# EAGLE schematic Weapons panel (EAGLE 6.5.0)
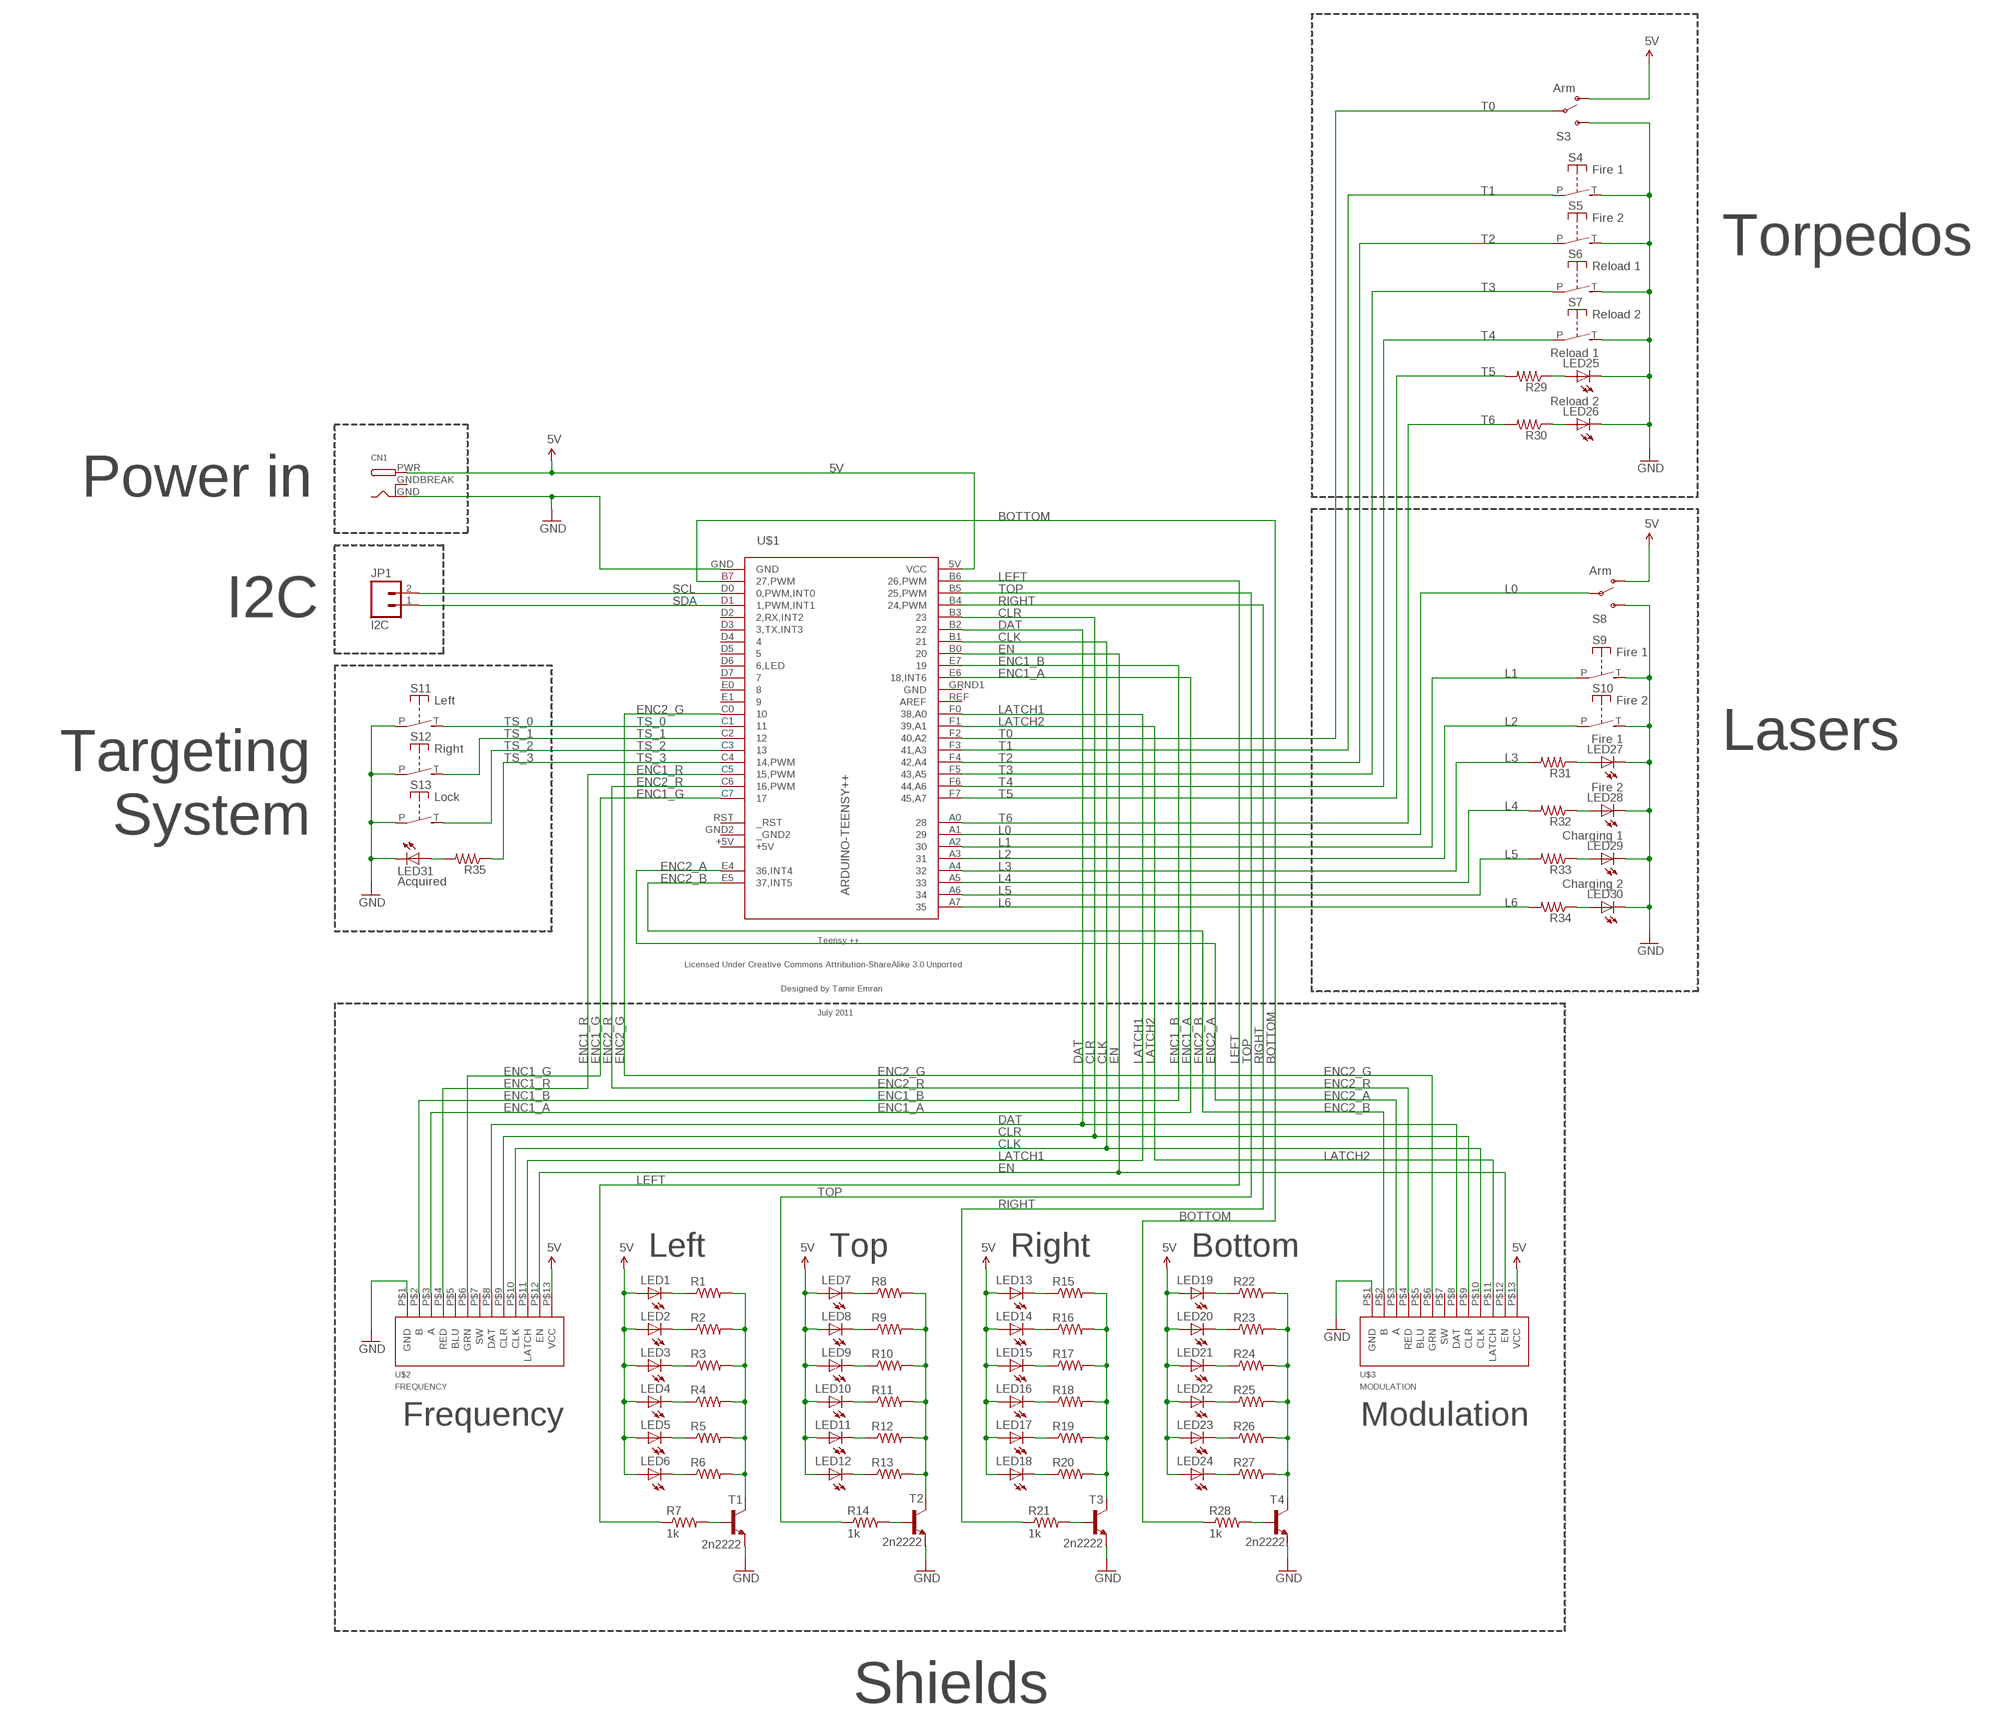
[diagram p0: schematic, sheet 1]

## Parts
CN1  DCBARRELPTH  [DCJACK_2MM_PTH]
JP1  I2C  M02PTH  [1X02]
LED1  LED5MM  [LED5MM]
LED2  LED5MM  [LED5MM]
LED3  LED5MM  [LED5MM]
LED4  LED5MM  [LED5MM]
LED5  LED5MM  [LED5MM]
LED6  LED5MM  [LED5MM]
LED7  LED5MM  [LED5MM]
LED8  LED5MM  [LED5MM]
LED9  LED5MM  [LED5MM]
LED10  LED5MM  [LED5MM]
LED11  LED5MM  [LED5MM]
LED12  LED5MM  [LED5MM]
LED13  LED5MM  [LED5MM]
LED14  LED5MM  [LED5MM]
LED15  LED5MM  [LED5MM]
LED16  LED5MM  [LED5MM]
LED17  LED5MM  [LED5MM]
LED18  LED5MM  [LED5MM]
LED19  LED5MM  [LED5MM]
LED20  LED5MM  [LED5MM]
LED21  LED5MM  [LED5MM]
LED22  LED5MM  [LED5MM]
LED23  LED5MM  [LED5MM]
LED24  LED5MM  [LED5MM]
LED25  Reload 1  LED5MM  [LED5MM]
LED26  Reload 2  LED5MM  [LED5MM]
LED27  Fire 1  LED5MM  [LED5MM]
LED28  Fire 2  LED5MM  [LED5MM]
LED29  Charging 1  LED5MM  [LED5MM]
LED30  Charging 2  LED5MM  [LED5MM]
LED31  Acquired  LED5MM  [LED5MM]
R1  RESISTORKIT  [AXIAL-0.3-KIT]
R2  RESISTORKIT  [AXIAL-0.3-KIT]
R3  RESISTORKIT  [AXIAL-0.3-KIT]
R4  RESISTORKIT  [AXIAL-0.3-KIT]
R5  RESISTORKIT  [AXIAL-0.3-KIT]
R6  RESISTORKIT  [AXIAL-0.3-KIT]
R7  1k  RESISTORKIT  [AXIAL-0.3-KIT]
R8  RESISTORKIT  [AXIAL-0.3-KIT]
R9  RESISTORKIT  [AXIAL-0.3-KIT]
R10  RESISTORKIT  [AXIAL-0.3-KIT]
R11  RESISTORKIT  [AXIAL-0.3-KIT]
R12  RESISTORKIT  [AXIAL-0.3-KIT]
R13  RESISTORKIT  [AXIAL-0.3-KIT]
R14  1k  RESISTORKIT  [AXIAL-0.3-KIT]
R15  RESISTORKIT  [AXIAL-0.3-KIT]
R16  RESISTORKIT  [AXIAL-0.3-KIT]
R17  RESISTORKIT  [AXIAL-0.3-KIT]
R18  RESISTORKIT  [AXIAL-0.3-KIT]
R19  RESISTORKIT  [AXIAL-0.3-KIT]
R20  RESISTORKIT  [AXIAL-0.3-KIT]
R21  1k  RESISTORKIT  [AXIAL-0.3-KIT]
R22  RESISTORKIT  [AXIAL-0.3-KIT]
R23  RESISTORKIT  [AXIAL-0.3-KIT]
R24  RESISTORKIT  [AXIAL-0.3-KIT]
R25  RESISTORKIT  [AXIAL-0.3-KIT]
R26  RESISTORKIT  [AXIAL-0.3-KIT]
R27  RESISTORKIT  [AXIAL-0.3-KIT]
R28  1k  RESISTORKIT  [AXIAL-0.3-KIT]
R29  R-US_0204/7  [0204/7]
R30  R-US_0204/7  [0204/7]
R31  R-US_0204/7  [0204/7]
R32  R-US_0204/7  [0204/7]
R33  R-US_0204/7  [0204/7]
R34  R-US_0204/7  [0204/7]
R35  R-US_0204/7  [0204/7]
S3  Arm  SWITCH-SPDTPTH  [SWITCH-SPDT]
S4  Fire 1  SPST  [JUDCOSPST]
S5  Fire 2  SPST  [JUDCOSPST]
S6  Reload 1  SPST  [JUDCOSPST]
S7  Reload 2  SPST  [JUDCOSPST]
S8  Arm  SWITCH-SPDTPTH  [SWITCH-SPDT]
S9  Fire 1  SPST  [JUDCOSPST]
S10  Fire 2  SPST  [JUDCOSPST]
S11  Left  SPST  [JUDCOSPST]
S12  Right  SPST  [JUDCOSPST]
S13  Lock  SPST  [JUDCOSPST]
T1  2n2222  2N2222-NPN-TO92-EBC  [TO92-EBC]
T2  2n2222  2N2222-NPN-TO92-EBC  [TO92-EBC]
T3  2n2222  2N2222-NPN-TO92-EBC  [TO92-EBC]
T4  2n2222  2N2222-NPN-TO92-EBC  [TO92-EBC]
U$1  ARDUINO-TEENSY++  [TEENSY++]
U$2  FREQUENCY  CIRCULAR_LED_BREAKOUT  [CIRCULAR_LED_BREAKOUT]
U$3  MODULATION  CIRCULAR_LED_BREAKOUT  [CIRCULAR_LED_BREAKOUT]

## Nets
5V: CN1.PWR LED1.A LED2.A LED3.A LED4.A LED5.A LED6.A LED7.A LED8.A LED9.A LED10.A LED11.A LED12.A LED13.A LED14.A LED15.A LED16.A LED17.A LED18.A LED19.A LED20.A LED21.A LED22.A LED23.A LED24.A S3.1(O) S8.1(O) U$1.5V(VCC) U$2.P$13(VCC) U$3.P$13(VCC)
BOTTOM: R28.P$1 U$1.B7(27,PWM)
CLK: U$1.B1 U$2.P$10(CLK) U$3.P$10(CLK)
CLR: U$1.B3 U$2.P$9(CLR) U$3.P$9(CLR)
DAT: U$1.B2 U$2.P$8(DAT) U$3.P$8(DAT)
EN: U$1.B0 U$2.P$12(EN) U$3.P$12(EN)
ENC1_A: U$1.E6(18,INT6) U$2.P$3(A)
ENC1_B: U$1.E7 U$2.P$2(B)
ENC1_G: U$1.C7 U$2.P$6(GRN)
ENC1_R: U$1.C5(15,PWM) U$2.P$4(RED)
ENC2_A: U$1.E4(36,INT4) U$3.P$3(A)
ENC2_B: U$1.E5(37,INT5) U$3.P$2(B)
ENC2_G: U$1.C0 U$3.P$6(GRN)
ENC2_R: U$1.C6(16,PWM) U$3.P$4(RED)
GND: CN1.GND LED25.K(C) LED26.K(C) LED27.K(C) LED28.K(C) LED29.K(C) LED30.K(C) LED31.K(C) S3.3(S) S4.T(S) S5.T(S) S6.T(S) S7.T(S) S8.3(S) S9.T(S) S10.T(S) S11.P S12.P S13.P T1.E T2.E T3.E T4.E U$1.GND U$2.P$1(GND) U$3.P$1(GND)
L0: S8.2(P) U$1.A1
L1: S9.P U$1.A2
L2: S10.P U$1.A3
L3: R31.2 U$1.A4
L4: R32.2 U$1.A5
L5: R33.2 U$1.A6
L6: R34.2 U$1.A7
LATCH1: U$1.F0(38,A0) U$2.P$11(LATCH)
LATCH2: U$1.F1(39,A1) U$3.P$11(LATCH)
LEFT: R7.P$1 U$1.B6(26,PWM)
N$1: LED1.K(C) R1.P$1
N$2: LED2.K(C) R2.P$1
N$3: LED3.K(C) R3.P$1
N$4: LED4.K(C) R4.P$1
N$5: LED5.K(C) R5.P$1
N$6: LED6.K(C) R6.P$1
N$7: R1.P$2 R2.P$2 R3.P$2 R4.P$2 R5.P$2 R6.P$2 T1.C
N$8: R7.P$2 T1.B
N$9: LED7.K(C) R8.P$1
N$10: LED8.K(C) R9.P$1
N$11: LED9.K(C) R10.P$1
N$12: LED10.K(C) R11.P$1
N$13: LED11.K(C) R12.P$1
N$14: LED12.K(C) R13.P$1
N$15: R8.P$2 R9.P$2 R10.P$2 R11.P$2 R12.P$2 R13.P$2 T2.C
N$16: R14.P$2 T2.B
N$17: LED13.K(C) R15.P$1
N$18: LED14.K(C) R16.P$1
N$19: LED15.K(C) R17.P$1
N$20: LED16.K(C) R18.P$1
N$21: LED17.K(C) R19.P$1
N$22: LED18.K(C) R20.P$1
N$23: R15.P$2 R16.P$2 R17.P$2 R18.P$2 R19.P$2 R20.P$2 T3.C
N$24: R21.P$2 T3.B
N$25: LED19.K(C) R22.P$1
N$26: LED20.K(C) R23.P$1
N$27: LED21.K(C) R24.P$1
N$28: LED22.K(C) R25.P$1
N$29: LED23.K(C) R26.P$1
N$30: LED24.K(C) R27.P$1
N$31: R22.P$2 R23.P$2 R24.P$2 R25.P$2 R26.P$2 R27.P$2 T4.C
N$32: R28.P$2 T4.B
N$33: LED25.A R29.1
N$34: LED26.A R30.1
N$35: LED27.A R31.1
N$36: LED28.A R32.1
N$37: LED29.A R33.1
N$38: LED30.A R34.1
N$39: LED31.A R35.2
RIGHT: R21.P$1 U$1.B4(24,PWM)
SCL: JP1.2 U$1.D0(0,PWM,INT0)
SDA: JP1.1 U$1.D1(1,PWM,INT1)
T0: S3.2(P) U$1.F2(40,A2)
T1: S4.P U$1.F3(41,A3)
T2: S5.P U$1.F4(42,A4)
T3: S6.P U$1.F5(43,A5)
T4: S7.P U$1.F6(44,A6)
T5: R29.2 U$1.F7(45,A7)
T6: R30.2 U$1.A0
TOP: R14.P$1 U$1.B5(25,PWM)
TS_0: S11.T(S) U$1.C1
TS_1: S12.T(S) U$1.C2
TS_2: S13.T(S) U$1.C3
TS_3: R35.1 U$1.C4(14,PWM)
Unconnected: U$1.D2(2,RX,INT2) U$1.D3(3,TX,INT3) U$1.D4 U$1.D5 U$1.D6(6,LED) U$1.D7 U$1.E0 U$1.E1 U$1.REF(AREF) U$1.RST(_RST) U$2.P$5(BLU) U$2.P$7(SW) U$3.P$5(BLU) U$3.P$7(SW)

## Notes on the sheet
- Torpedos
- Power in
- I2C
- Lasers
- Targeting
  System
- Left | Top | Right | Bottom
- Frequency | Modulation
- Shields

## Power pins joined to a net without a drawn wire
+5V: U$1.+5V
_GND2: U$1.GND2(_GND2)
GND: U$1.GRND1(GND)
GNDBREAK: CN1.GNDBREAK

## Library data of the parts
CN1 = adafruit:DCBARREL: 2.0mm DC Barrel Jack DCJACK_2MM_PTH - Through Hole Jack (4UConnector: 05537)
JP1 = SparkFun-Connectors:M02: Standard 2-pin 0.1" header. Use with - straight break away headers ( PRT-00116) - right angle break away headers (PRT-00553) - swiss pins (PRT-00743) - machine pins (PRT-00117) - female headers (PRT-00115) Molex polarized connector foot print use with: PRT-08233 with associated crimp pins and housings. 2.54_SCREWTERM for use with PRT-10571. 3.5mm Screw Terminal footprints for PRT-08084 5mm Screw Terminal footprints for use with PRT-08433
LED1-LED31 = adafruit:LED: LED OSRAM: - CHIPLED LG R971, LG N971, LY N971, LG Q971, LY Q971, LO R971, LY R971 LH N974, LH R974 LS Q976, LO Q976, LY Q976 LO Q996 - Hyper CHIPLED LW Q18S LB Q993, LB Q99A, LB R99A - SideLED LS A670, LO A670, LY A670, LG A670, LP A670 LB A673, LV A673, LT A673, LW A673 LH A674 LY A675 LS A676, LA A676, LO A676, LY A676, LW A676 LS A679, LY A679, LG A679 - Hyper Micro SIDELED® LS Y876, LA Y876, LO Y876, LY Y876 LT Y87S - SmartLED LW L88C, LW L88S LB L89C, LB L89S, LG L890 LS L89K, LO L89K, LY L89K LS L896, LA L896, LO L896, LY L896 - TOPLED LS T670, LO T670, LY T670, LG T670, LP T670 LSG T670, LSP T670, LSY T670, LOP T670, LYG T670 LG T671, LOG T671, LSG T671 LB T673, LV T673, LT T673, LW T673 LH T674 LS T676, LA T676, LO T676, LY T676, LB T676, LH T676, LSB T676, LW T676 LB T67C, LV T67C, LT T67C, LS T67K, LO T67K, LY T67K, LW E67C LS E67B, LA E67B, LO E67B, LY E67B, LB E67C, LV E67C, LT E67C LW T67C LS T679, LY T679, LG T679 LS T770, LO T770, LY T770, LG T770, LP T770 LB T773, LV T773, LT T773, LW T773 LH T774 LS E675, LA E675, LY E675, LS T675 LS T776, LA T776, LO T776, LY T776, LB T776 LHGB T686 LT T68C, LB T68C - Hyper Mini TOPLED® LB M676 - Mini TOPLED Santana® LG M470 LS M47K, LO M47K, LY M47K Source: http://www.osram.convergy.de/
R1-R28 = SparkFun-Passives:RESISTOR: Resistor Basic schematic elements and footprints for 0603, 1206, and PTH resistors.
R29-R35 = resistor:R-US_: RESISTOR, American symbol
S3 S8 = SparkFun-Electromechanical:SWITCH-SPDT: SPDT Switch Simple slide switch, Spark Fun Electronics SKU : COM-00102 DPDT SMT slide switch, AYZ0202, SWCH-08179
S4-S7 S9-S13 = adafruit:SPST: Judco 50-0015-00
T1-T4 = transistor-neu-to92:*-NPN-: NPN Transistror
U$1 = teensypp:ARDUINO-TEENSY++: Teensy ++ Original Design by Mark Gross Modified Design by Tamir Emran Licensed Under Creative Commons Attribution-ShareAlike 3.0 Unported (CC BY-SA 3.0)
U$2 U$3 = circular_led_breakout:CIRCULAR_LED_BREAKOUT